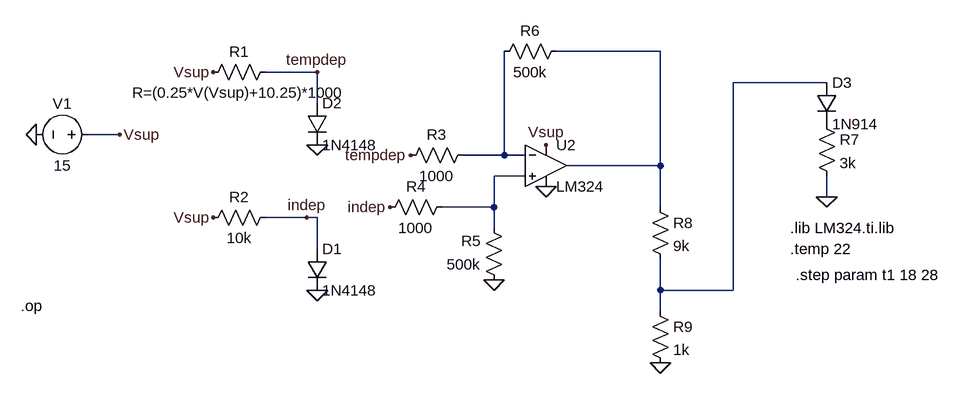
[diagram p0: schematic Lab1.asc]
Lab1.asc, the LTspice schematic file:
Version 4
SHEET 1 880 680
WIRE 128 -128 -32 -128
WIRE -400 -96 -480 -96
WIRE 384 -80 240 -80
WIRE -400 -48 -400 -96
WIRE -704 0 -752 0
WIRE -112 32 -112 -128
WIRE -112 32 -176 32
WIRE -80 32 -112 32
WIRE 128 48 128 -128
WIRE 128 48 -16 48
WIRE -80 64 -128 64
WIRE 384 96 384 64
WIRE -128 112 -128 64
WIRE -128 112 -208 112
WIRE 128 112 128 48
WIRE -416 128 -480 128
WIRE -400 128 -416 128
WIRE -128 144 -128 112
WIRE -400 176 -400 128
WIRE 128 240 128 192
WIRE 240 240 240 -80
WIRE 240 240 128 240
WIRE 128 272 128 240
FLAG -832 0 0
FLAG -48 80 0
FLAG -48 16 Vsup
FLAG -400 16 0
FLAG -400 240 0
FLAG -400 -96 tempdep
FLAG -560 -96 Vsup
FLAG -416 128 indep
FLAG -128 224 0
FLAG -256 32 tempdep
FLAG -288 112 indep
FLAG -704 0 Vsup
FLAG -560 128 Vsup
FLAG 384 96 0
FLAG 128 352 0
SYMBOL voltage -736 0 R90
WINDOW 0 -32 56 VBottom 2
WINDOW 3 32 56 VTop 2
WINDOW 123 0 0 Left 0
WINDOW 39 0 0 Left 0
SYMATTR InstName V1
SYMATTR Value 15
SYMBOL OpAmps\\opamp2 -48 -16 R0
SYMATTR InstName U2
SYMATTR Value LM324
SYMBOL diode -416 176 R0
SYMATTR InstName D1
SYMATTR Value 1N4148
SYMBOL diode -416 -48 R0
SYMATTR InstName D2
SYMATTR Value 1N4148
SYMATTR Value2 temp={t1}
SYMBOL res -464 -112 R90
WINDOW 0 0 56 VBottom 2
WINDOW 3 32 56 VTop 2
SYMATTR InstName R1
SYMATTR Value R=(0.25*V(Vsup)+10.25)*1000
SYMBOL res -464 112 R90
WINDOW 0 0 56 VBottom 2
WINDOW 3 32 56 VTop 2
SYMATTR InstName R2
SYMATTR Value 10k
SYMBOL res -160 16 R90
WINDOW 0 0 56 VBottom 2
WINDOW 3 32 56 VTop 2
SYMATTR InstName R3
SYMATTR Value 1000
SYMBOL res -192 96 R90
WINDOW 0 0 56 VBottom 2
WINDOW 3 32 56 VTop 2
SYMATTR InstName R4
SYMATTR Value 1000
SYMBOL res -112 240 R180
WINDOW 0 36 76 Left 2
WINDOW 3 36 40 Left 2
SYMATTR InstName R5
SYMATTR Value 500k
SYMBOL res -128 -112 R270
WINDOW 0 32 56 VTop 2
WINDOW 3 0 56 VBottom 2
SYMATTR InstName R6
SYMATTR Value 500k
SYMBOL diode 368 -80 R0
SYMATTR InstName D3
SYMATTR Value 1N914
SYMATTR Description Light Emitting Diode
SYMATTR Type led
SYMBOL res 368 -32 R0
SYMATTR InstName R7
SYMATTR Value 3k
SYMBOL res 112 96 R0
SYMATTR InstName R8
SYMATTR Value 9k
SYMBOL res 112 256 R0
SYMATTR InstName R9
SYMATTR Value 1k
TEXT 328 144 Left 2 !.lib LM324.ti.lib
TEXT 328 176 Left 2 !.temp 22
TEXT 336 216 Left 2 !.step param t1 18 28
TEXT -856 264 Left 2 !.op

The netlist it stands for:
* Lab1.asc
V1 Vsup 0 15
XU2 N004 N003 Vsup 0 N001 LM324  ; pins In+ In- V+ V- OUT
D1 indep 0 1N4148
D2 tempdep 0 1N4148 temp={t1}
R1 tempdep Vsup R=(0.25*V(Vsup)+10.25)*1000
R2 indep Vsup 10k
R3 N003 tempdep 1000
R4 N004 indep 1000
R5 0 N004 500k
R6 N003 N001 500k
D3 N002 P001 1N914
R7 P001 0 3k
R8 N001 N002 9k
R9 N002 0 1k
.model D D
.lib standard.dio
.lib LM324.ti.lib
.temp 22
.step param t1 18 28
.op
.backanno
.end